# EAGLE design controller (EAGLE 6.4)
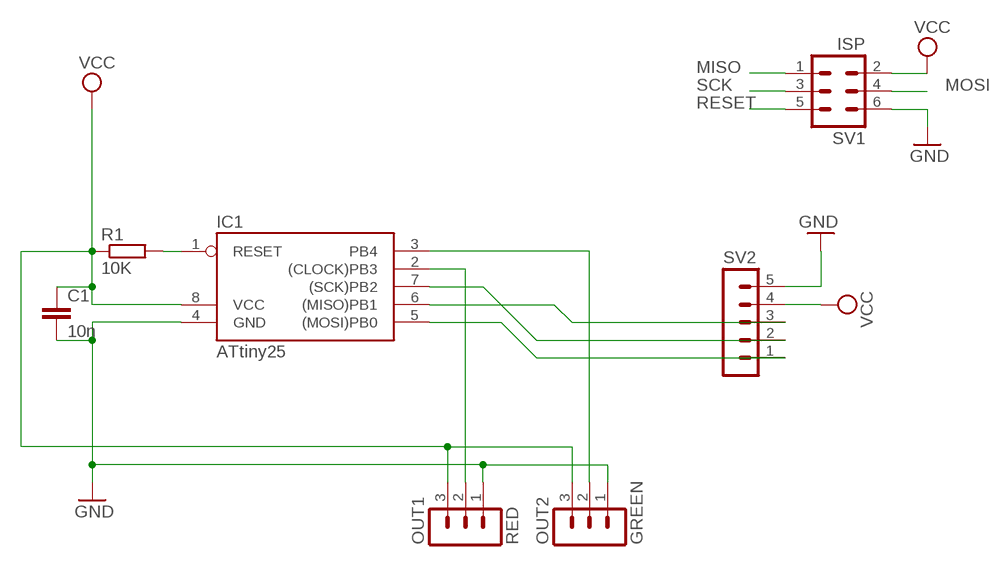
[diagram p0: schematic, sheet 1]

## Parts
C1  10n  C-EU025-024X044  [C025-024X044]
IC1  ATtiny25  AT90S2343P  [DIL08]
OUT1  RED  MA03-1  [MA03-1]
OUT2  GREEN  MA03-1  [MA03-1]
R1  10K  R-EU_0207/7  [0207/7]
SV1  ISP  MA03-2  [MA03-2]
SV2  MA05-1  [MA05-1]

## Nets
GND: C1.2 IC1.4(GND) OUT1.1 OUT2.1 SV1.6 SV2.5
MISO: IC1.6((MISO)PB1) SV1.1 SV2.3
MOSI: IC1.5((MOSI)PB0) SV1.4 SV2.1
N$1: IC1.3(PB4) OUT2.2
N$2: IC1.2((CLOCK)PB3) OUT1.2
RESET: IC1.1(RESET) R1.2 SV1.5
SCK: IC1.7((SCK)PB2) SV1.3 SV2.2
VCC: C1.1 IC1.8(VCC) OUT1.3 OUT2.3 R1.1 SV1.2 SV2.4

## Library data of the parts
C1 = resistor:C-EU: CAPACITOR, European symbol
IC1 = atmel:AT90*2343: MICROCONTROLLER 2 Kbytes FLASH 128 bytes SRAM 128 bytes EEPROM; OC_FARNELL: unknown; OC_NEWARK: unknown
OUT1 OUT2 = con-lstb:MA03-1: PIN HEADER; OC_FARNELL: unknown; OC_NEWARK: unknown
R1 = resistor:R-EU_: RESISTOR, European symbol
SV1 = con-lstb:MA03-2: PIN HEADER; OC_FARNELL: unknown; OC_NEWARK: unknown
SV2 = con-lstb:MA05-1: PIN HEADER; OC_FARNELL: unknown; OC_NEWARK: unknown

## Board
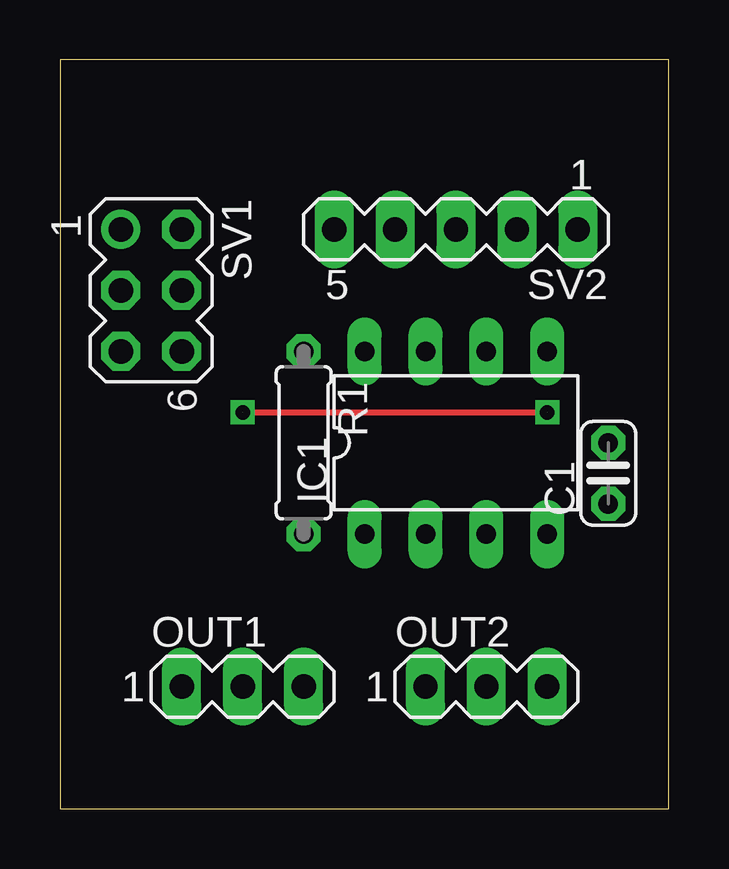
[diagram p1: board, top side]
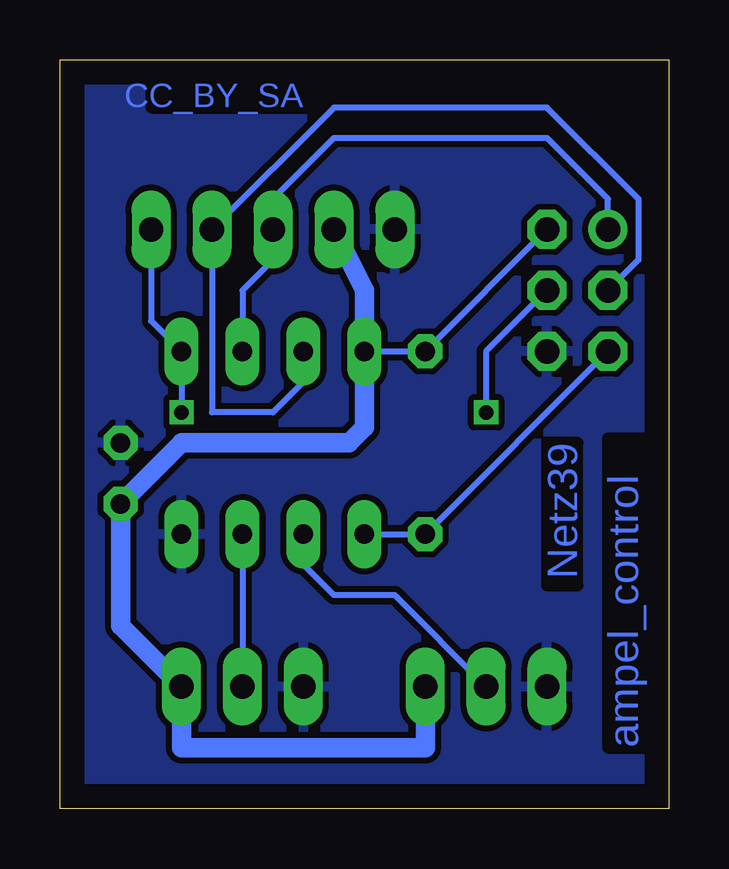
[diagram p2: board, bottom side, seen from below]

Size 25.39 x 31.19 mm. Coordinates in mm from the lower left corner, seen from the top.
Outline: 0,0 25.39,0 25.39,31.19 0,31.19 0,0
Copper layers (1*16): Top 0.035mm / dielectric 1.5mm / Bottom 0.035mm
Design rules "default *": minimum track width 10mil, minimum drill 24mil, track to track 10mil, track to pad 10mil, pad to pad 8mil, via to via 8mil, smd to smd 8mil, copper to edge 40mil, drill to drill 8mil, minimum pad ring 12mil, minimum via ring 8mil, stop-mask expansion 4mil, vias tented up to drill 0mil, thermal gap 10mil

### Footprints (pad centres in the part's own frame; a part is rotated, then mirrored left to right if it is on the bottom)
C025-024X044 = drill 0.813 octagon: 1 -1.27,0; 2 1.27,0
DIL08 = drill 0.813 long: 1 -3.81,-3.81; 2 -1.27,-3.81; 3 1.27,-3.81; 4 3.81,-3.81; 5 3.81,3.81; 6 1.27,3.81; 7 -1.27,3.81; 8 -3.81,3.81
MA03-1 = drill 1.016 long: 1 -2.54,0; 2 0,0; 3 2.54,0
0207/7 = drill 0.813 octagon: 1 -3.81,0; 2 3.81,0
MA03-2 = drill 1.016: 1 -2.54,-1.27 | drill 1.016 octagon: 2 -2.54,1.27; 3 0,-1.27; 4 0,1.27; 5 2.54,-1.27; 6 2.54,1.27
MA05-1 = drill 1.016 long: 1 -5.08,0; 2 -2.54,0; 3 0,0; 4 2.54,0; 5 5.08,0

### Placement (x,y rotation side)
C1  22.86,13.97 90 top
IC1  16.51,15.24 0 top
OUT1  7.62,5.08 0 top
OUT2  17.78,5.08 0 top
R1  10.16,15.24 270 top
SV1  3.81,21.59 270 top
SV2  16.51,24.13 180 top

### Tracks (layer width: path | path; a pad name or v marks a point on that pad's centre or on a via)
GND
  pour Bottom (isolate 0.254): 0,31.75 25.4,31.75 25.4,0 0,0
MISO
  Bottom 0.254: IC1.6 17.78,21.59 16.51,22.86 SV2.3 16.51,25.4 13.97,27.94 5.08,27.94 2.54,25.4 SV1.1
MOSI  (2 unrouted)
  Top 0.254: 7.62,16.51 20.32,16.51
  Bottom 0.254: SV2.1 21.59,20.32 IC1.5 20.32,16.51 | SV1.4 7.62,19.05 7.62,16.51
N$1
  Bottom 0.254: IC1.3 OUT2.2
N$2
  Bottom 0.254: OUT1.2 11.43,8.89 13.97,8.89 15.24,10.16 IC1.2
N$3  (via drill 0.6)
  other vias: 20.32,16.51
N$4  (via drill 0.6)
  other vias: 7.62,16.51
RESET
  Bottom 0.254: IC1.1 R1.2 SV1.5
SCK
  Bottom 0.254: SV1.3 1.27,22.86 1.27,25.4 5.08,29.21 13.97,29.21 SV2.2 19.05,16.51 16.51,16.51 15.24,17.78 IC1.7
VCC
  Bottom 0.254: IC1.8 R1.1 SV1.2
  Bottom 0.813: SV2.4 12.7,21.59 IC1.8 12.7,15.88 13.34,15.24 20.32,15.24 C1.1 22.86,7.62 OUT2.3 20.32,2.54 10.16,2.54 OUT1.3

### Text on the board
Bottom: CC_BY_SA | Netz39 | ampel_control